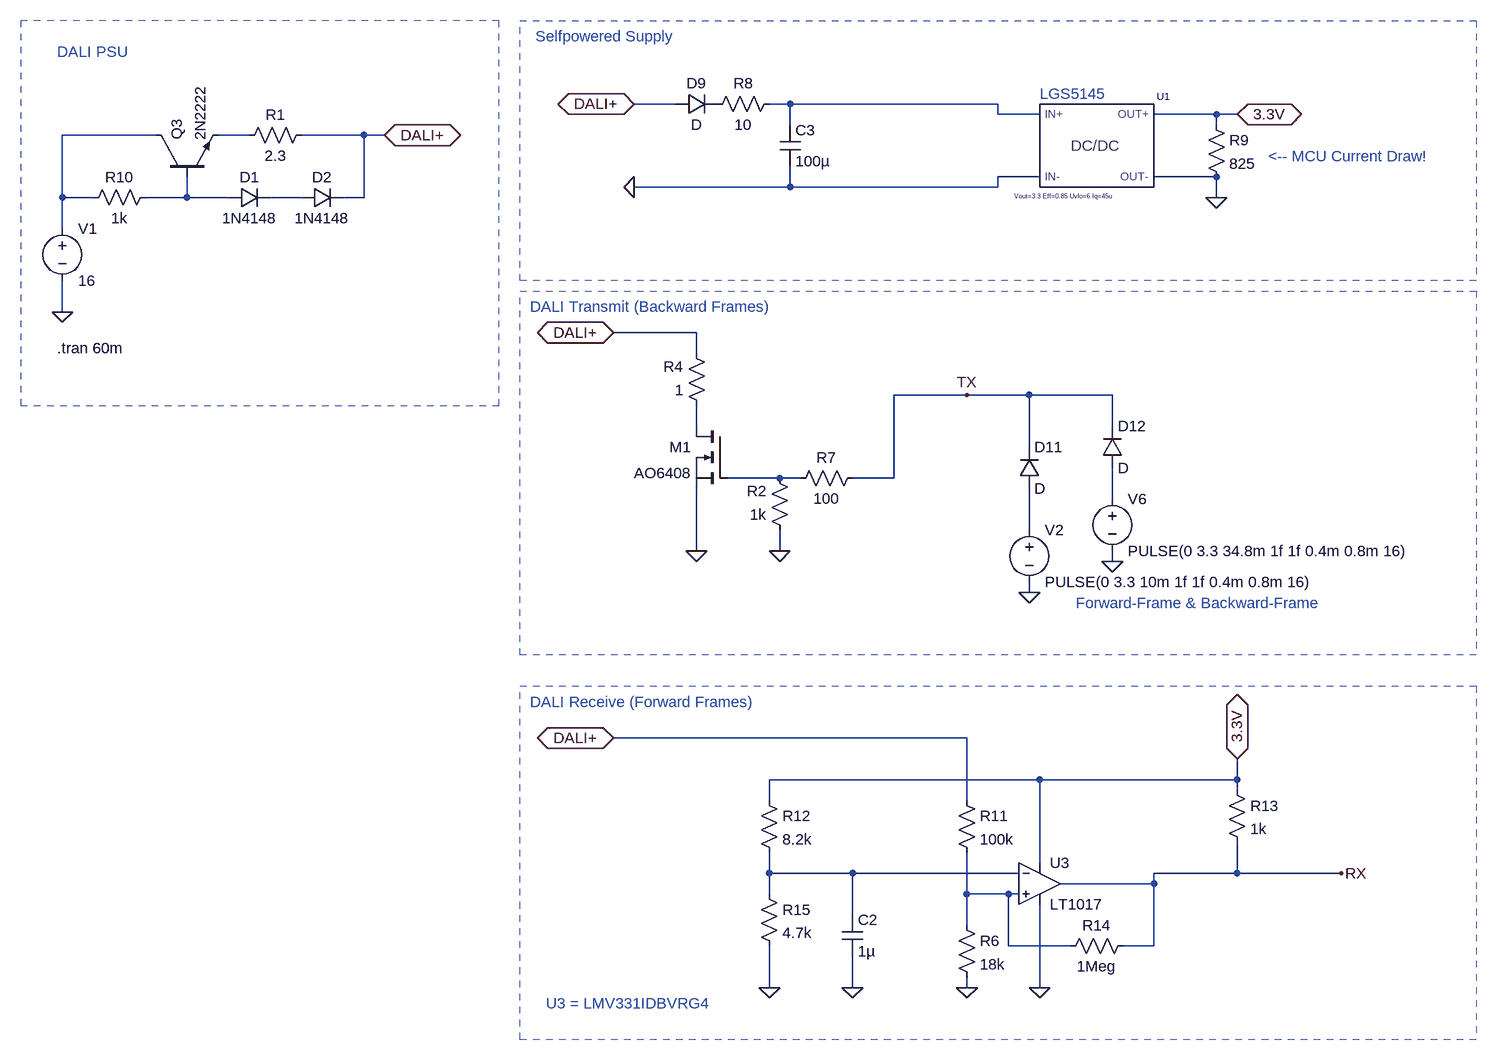
[diagram p0: schematic Phy_Non-Isolated.asc]
Phy_Non-Isolated.asc, the LTspice schematic file:
Version 4
SHEET 1 22984 1472
WIRE 1152 -464 1088 -464
WIRE 1328 -464 1296 -464
WIRE 1648 -464 1328 -464
WIRE 1648 -448 1648 -464
WIRE 1712 -448 1648 -448
WIRE 1984 -448 1888 -448
WIRE 2016 -448 1984 -448
WIRE 1328 -432 1328 -464
WIRE 1984 -432 1984 -448
WIRE 352 -416 208 -416
WIRE 496 -416 448 -416
WIRE 672 -416 576 -416
WIRE 704 -416 672 -416
WIRE 1712 -352 1648 -352
WIRE 1984 -352 1888 -352
WIRE 1328 -336 1328 -368
WIRE 1328 -336 1088 -336
WIRE 1648 -336 1648 -352
WIRE 1648 -336 1328 -336
WIRE 208 -320 208 -416
WIRE 256 -320 208 -320
WIRE 400 -320 400 -352
WIRE 400 -320 336 -320
WIRE 464 -320 400 -320
WIRE 576 -320 528 -320
WIRE 672 -320 672 -416
WIRE 672 -320 640 -320
WIRE 1984 -320 1984 -352
WIRE 208 -272 208 -320
WIRE 208 -144 208 -192
WIRE 1184 -112 1056 -112
WIRE 1184 -80 1184 -112
WIRE 1600 -16 1488 -16
WIRE 1696 -16 1600 -16
WIRE 1824 -16 1696 -16
WIRE 1184 32 1184 0
WIRE 1824 32 1824 -16
WIRE 1696 64 1696 -16
WIRE 1312 112 1232 112
WIRE 1344 112 1312 112
WIRE 1488 112 1488 -16
WIRE 1488 112 1424 112
WIRE 1824 144 1824 96
WIRE 1696 192 1696 128
WIRE 1184 224 1184 128
WIRE 1312 224 1312 192
WIRE 1824 240 1824 224
WIRE 1696 288 1696 272
WIRE 1600 512 1056 512
WIRE 1712 576 1296 576
WIRE 2016 576 2016 544
WIRE 2016 576 1712 576
WIRE 2016 592 2016 576
WIRE 1296 608 1296 576
WIRE 1600 608 1600 512
WIRE 1712 704 1712 576
WIRE 1296 720 1296 688
WIRE 1424 720 1296 720
WIRE 1680 720 1424 720
WIRE 2016 720 2016 672
WIRE 2016 720 1888 720
WIRE 2176 720 2016 720
WIRE 1888 736 1888 720
WIRE 1888 736 1744 736
WIRE 1296 752 1296 720
WIRE 1600 752 1600 688
WIRE 1664 752 1600 752
WIRE 1680 752 1664 752
WIRE 1424 784 1424 720
WIRE 1600 800 1600 752
WIRE 1664 832 1664 752
WIRE 1760 832 1664 832
WIRE 1888 832 1888 736
WIRE 1888 832 1840 832
WIRE 1296 896 1296 832
WIRE 1424 896 1424 848
WIRE 1600 896 1600 880
WIRE 1712 896 1712 768
FLAG 1696 288 0
FLAG 1600 -16 TX
FLAG 1088 -464 DALI+
IOPIN 1088 -464 BiDir
FLAG 1056 512 DALI+
IOPIN 1056 512 BiDir
FLAG 2176 720 RX
FLAG 1824 240 0
FLAG 1056 -112 DALI+
IOPIN 1056 -112 BiDir
FLAG 208 -144 0
FLAG 1984 -320 0
FLAG 2016 -448 3.3V
IOPIN 2016 -448 BiDir
FLAG 2016 544 3.3V
IOPIN 2016 544 BiDir
FLAG 704 -416 DALI+
IOPIN 704 -416 BiDir
FLAG 1712 896 0
FLAG 1424 896 0
FLAG 1184 224 0
FLAG 1088 -336 0
FLAG 1312 224 0
FLAG 1600 896 0
FLAG 1296 896 0
SYMBOL voltage 208 -288 R0
WINDOW 123 0 0 Left 0
WINDOW 39 0 0 Left 0
SYMATTR InstName V1
SYMATTR Value 16
SYMBOL voltage 1696 176 R0
WINDOW 123 0 0 Left 0
WINDOW 39 0 0 Left 0
SYMATTR InstName V2
SYMATTR Value PULSE(0 3.3 10m 1f 1f 0.4m 0.8m 16)
SYMBOL res 1440 96 R90
WINDOW 0 0 56 VBottom 2
WINDOW 3 32 56 VTop 2
SYMATTR InstName R7
SYMATTR Value 100
SYMBOL diode 1152 -480 M90
WINDOW 0 0 32 VBottom 2
WINDOW 3 32 32 VTop 2
SYMATTR InstName D9
SYMBOL cap 1312 -432 R0
SYMATTR InstName C3
SYMATTR Value 100µ
SYMBOL res 480 -400 R270
WINDOW 0 32 56 VTop 2
WINDOW 3 0 56 VBottom 2
SYMATTR InstName R1
SYMATTR Value 2.3
SYMBOL npn 352 -352 R270
SYMATTR InstName Q3
SYMATTR Value 2N2222
SYMBOL res 352 -336 R90
WINDOW 0 0 56 VBottom 2
WINDOW 3 32 56 VTop 2
SYMATTR InstName R10
SYMATTR Value 1k
SYMBOL diode 464 -304 R270
WINDOW 0 32 32 VTop 2
WINDOW 3 0 32 VBottom 2
SYMATTR InstName D1
SYMATTR Value 1N4148
SYMBOL diode 576 -304 R270
WINDOW 0 32 32 VTop 2
WINDOW 3 0 32 VBottom 2
SYMATTR InstName D2
SYMATTR Value 1N4148
SYMBOL res 2000 576 R0
SYMATTR InstName R13
SYMATTR Value 1k
SYMBOL Comparators\\LT1017 1712 736 R0
SYMATTR InstName U3
SYMBOL voltage 1824 128 R0
WINDOW 123 0 0 Left 0
WINDOW 39 0 0 Left 0
SYMATTR InstName V6
SYMATTR Value PULSE(0 3.3 34.8m 1f 1f 0.4m 0.8m 16)
SYMBOL diode 1680 128 M180
WINDOW 0 24 64 Left 2
WINDOW 3 24 0 Left 2
SYMATTR InstName D11
SYMBOL diode 1808 96 M180
WINDOW 0 24 64 Left 2
WINDOW 3 24 0 Left 2
SYMATTR InstName D12
SYMBOL res 1200 16 R180
WINDOW 0 36 76 Left 2
WINDOW 3 36 40 Left 2
SYMATTR InstName R4
SYMATTR Value 1
SYMBOL cap 1408 784 R0
SYMATTR InstName C2
SYMATTR Value 1µ
SYMBOL IDEAL_DCDC 1744 -400 R0
SYMATTR SpiceLine Vout=3.3 Eff=0.85 Uvlo=6 Iq=45u
SYMATTR InstName U1
SYMBOL res 1312 -480 R90
WINDOW 0 0 56 VBottom 2
WINDOW 3 32 56 VTop 2
SYMATTR InstName R8
SYMATTR Value 10
SYMBOL res 1968 -448 R0
SYMATTR InstName R9
SYMATTR Value 825
SYMBOL res 1856 816 R90
WINDOW 0 0 56 VBottom 2
WINDOW 3 32 56 VTop 2
SYMATTR InstName R14
SYMATTR Value 1Meg
SYMBOL nmos 1232 32 M0
SYMATTR InstName M1
SYMATTR Value AO6408
SYMBOL res 1328 208 R180
WINDOW 0 36 76 Left 2
WINDOW 3 36 40 Left 2
SYMATTR InstName R2
SYMATTR Value 1k
SYMBOL res 1584 784 R0
SYMATTR InstName R6
SYMATTR Value 18k
SYMBOL res 1584 592 R0
SYMATTR InstName R11
SYMATTR Value 100k
SYMBOL res 1280 592 R0
SYMATTR InstName R12
SYMATTR Value 8.2k
SYMBOL res 1280 736 R0
SYMATTR InstName R15
SYMATTR Value 4.7k
TEXT 200 -88 Left 2 !.tran 60m
TEXT 1712 -480 Left 2 ;LGS5145
TEXT 952 920 Left 2 ;U3 = LMV331IDBVRG4
TEXT 2064 -384 Left 2 ;<-- MCU Current Draw!
TEXT 1768 304 Left 2 ;Forward-Frame & Backward-Frame
TEXT 200 -544 Left 2 ;DALI PSU
TEXT 936 -568 Left 2 ;Selfpowered Supply
TEXT 928 -152 Left 2 ;DALI Transmit (Backward Frames)
TEXT 928 456 Left 2 ;DALI Receive (Forward Frames)
RECTANGLE Normal 2384 -192 912 -592 2
RECTANGLE Normal 2384 384 912 -176 2
RECTANGLE Normal 2384 976 912 432 2
RECTANGLE Normal 144 0 880 -592 2

The netlist it stands for:
* Phy_Non-Isolated.asc
V1 N002 0 16
V2 N009 0 PULSE(0 3.3 10m 1f 1f 0.4m 0.8m 16)
R7 TX N007 100
D9 DALI+ P001 D
C3 N001 0 100µ
R1 N003 DALI+ 2.3
Q3 N002 N004 N003 0 2N2222
R10 N004 N002 1k
D1 N004 N005 1N4148
D2 N005 DALI+ 1N4148
R13 3.3V RX 1k
XU3 N011 N010 3.3V 0 RX LT1017  ; pins In+ In- V+ V- OUT
V6 N008 0 PULSE(0 3.3 34.8m 1f 1f 0.4m 0.8m 16)
D11 N009 TX D
D12 N008 TX D
R4 N006 DALI+ 1
C2 N010 0 1µ
XU1 N001 0 3.3V 0 IDEAL_DCDC IDEAL_DCDC Vout=3.3 Eff=0.85 Uvlo=6 Iq=45u  ; pins IN+ IN- OUT+ OUT-
R8 N001 P001 10
R9 3.3V 0 825
R14 RX N011 1Meg
M1 N006 N007 0 0 AO6408
R2 0 N007 1k
R6 N011 0 18k
R11 DALI+ N011 100k
R12 3.3V N010 8.2k
R15 N010 0 4.7k
.model D D
.lib standard.dio
.model NPN NPN
.model PNP PNP
.lib standard.bjt
.model NMOS NMOS
.model PMOS PMOS
.lib standard.mos
.tran 60m
* LGS5145
* U3 = LMV331IDBVRG4
* <-- MCU Current Draw!
* Forward-Frame & Backward-Frame
* DALI PSU
* Selfpowered Supply
* DALI Transmit (Backward Frames)
* DALI Receive (Forward Frames)
.lib IDEAL_DCDC.lib
.backanno
.end